# EAGLE design AIRDC (EAGLE 9.1.3)
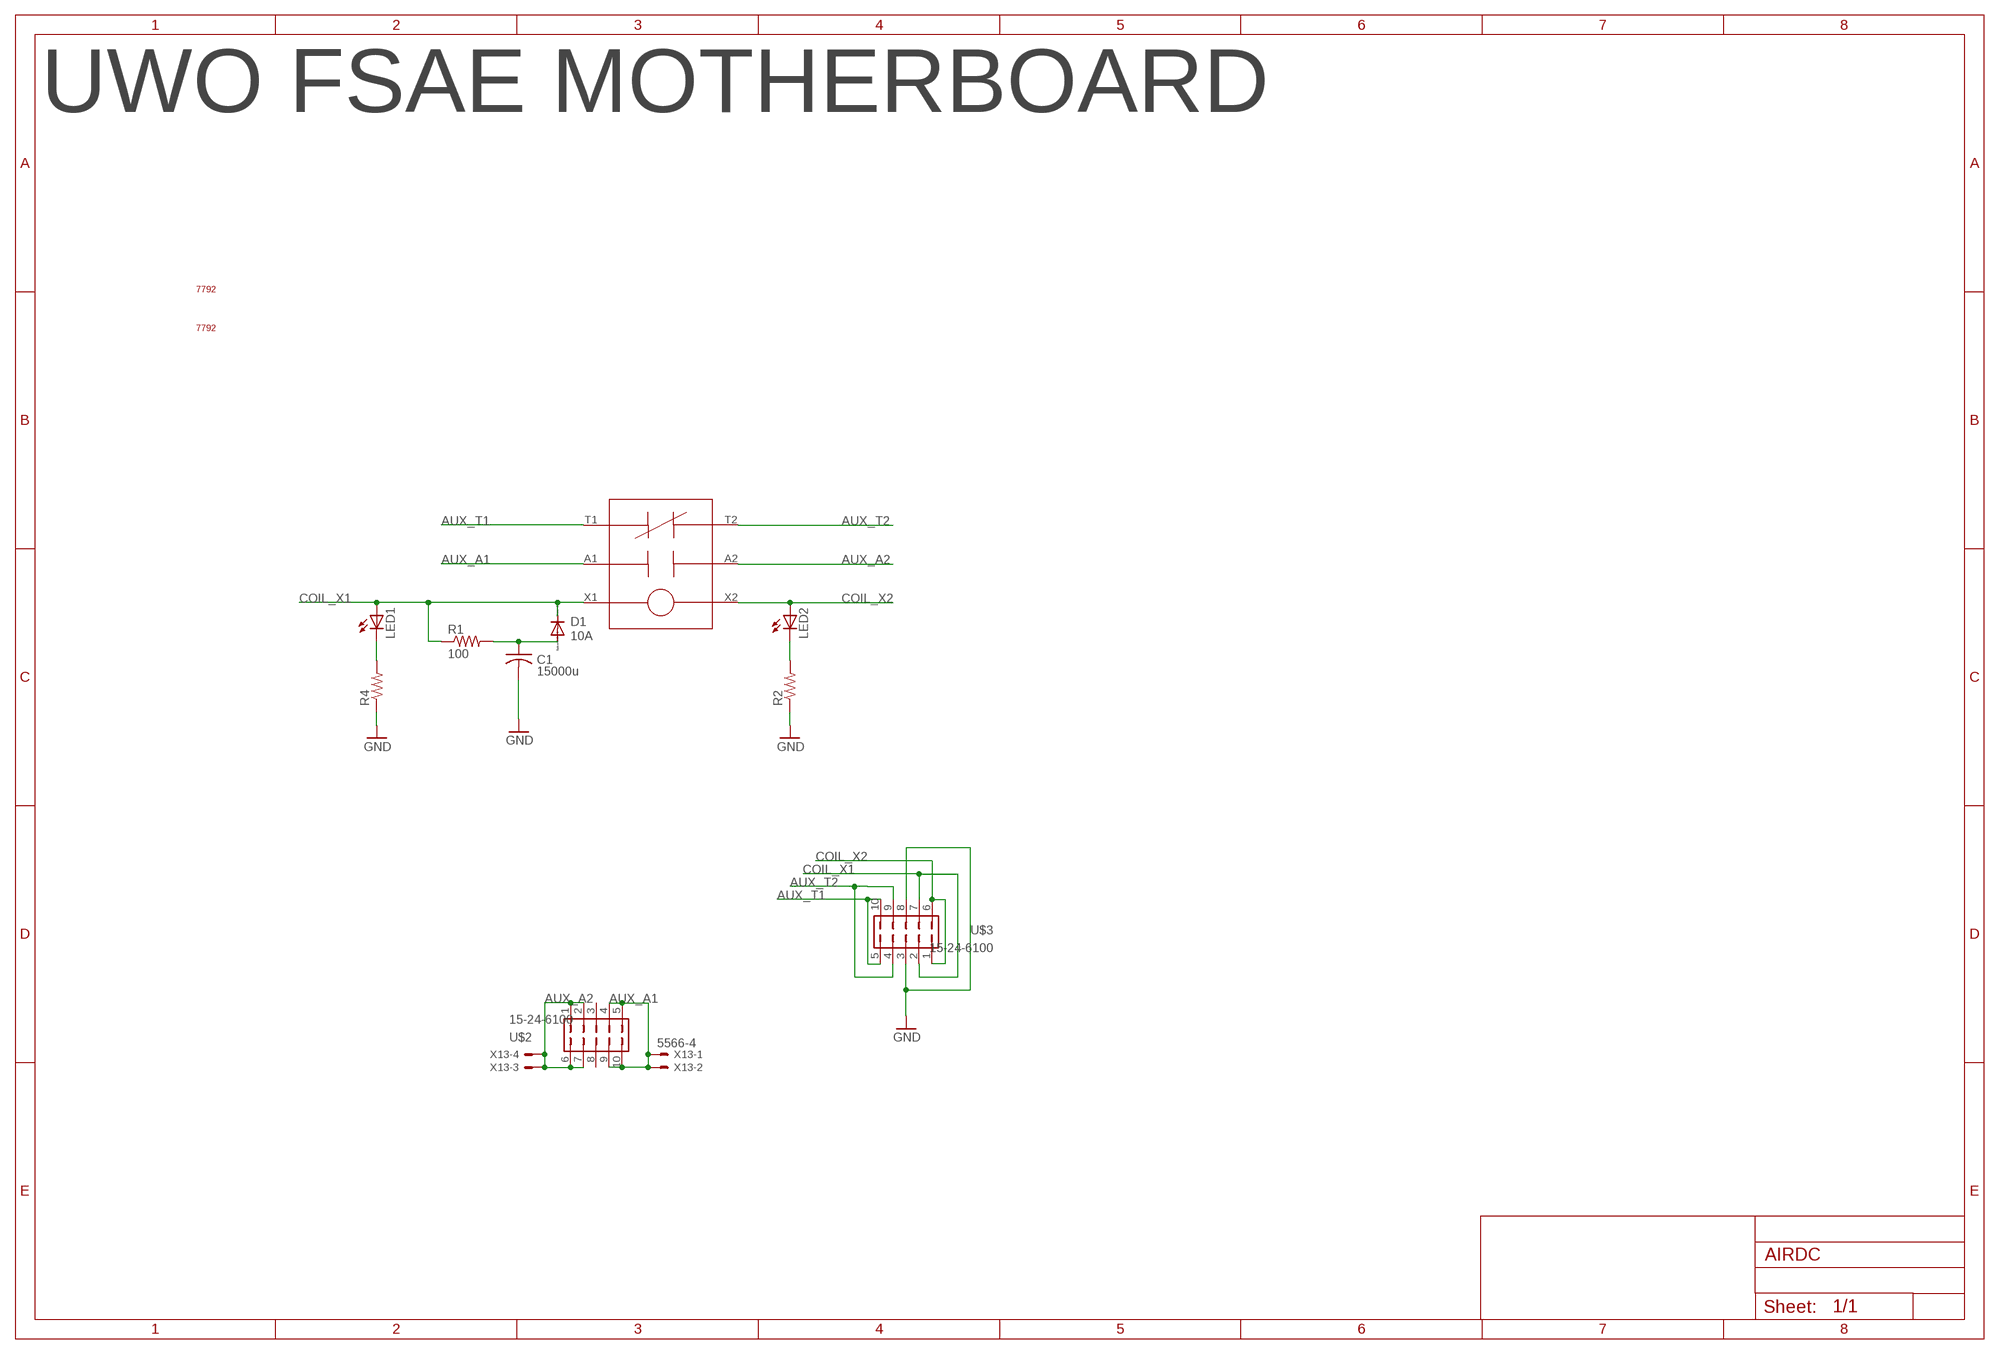
[diagram p0: schematic, sheet 1]

## Parts
C1  15000u  AIR_HOLDUP_CAP  [CAPPRD750W65D1800H3700B]
D1  10A  AIR_HOLDUP_DIODE  [DIOAD1570W120L850D500B]
LED1  LED3MM  [LED3MM]
LED2  LED3MM  [LED3MM]
R1  100  AIR_HOLDUP_RESISTOR  [RESAD976W63L650D250B]
R2  R-US_R0805  [R0805]
R4  R-US_R0805  [R0805]
U$1  GV224  [GV224]
U$2  15-24-6100  [15-24-6100]
U$3  15-24-6100  [15-24-6100]
U$4  7792  [7792]
U$5  7792  [7792]
X13  5566-4  [5566-4]

## Nets
AUX_A1 [HV]: U$1.A1 U$2.4 U$2.5 U$2.9 U$2.10 X13.1 X13.2
AUX_A2 [HV]: U$1.A2 U$2.1 U$2.2 U$2.6 U$2.7 X13.3 X13.4
AUX_T1: U$1.T1 U$3.5 U$3.10
AUX_T2: U$1.T2 U$3.4 U$3.9
COIL_X1: D1.1(C) LED1.A R1.1 U$1.X1 U$3.2 U$3.7
COIL_X2: LED2.A U$1.X2 U$3.1 U$3.6
GND: C1.2 R2.1 R4.1 U$3.3 U$3.8
N$1: LED2.K(C) R2.2
N$3: C1.1 D1.2(A) R1.2
N$5: LED1.K(C) R4.2
Unconnected: U$2.3 U$2.8

## Notes on the sheet
- UWO FSAE MOTHERBOARD

## Library data of the parts
C1 = Main:AIR_HOLDUP_CAP
D1 = Main:AIR_HOLDUP_DIODE
LED1 LED2 = ACC-MB-R0:LED: LED OSRAM: - CHIPLED LG R971, LG N971, LY N971, LG Q971, LY Q971, LO R971, LY R971 LH N974, LH R974 LS Q976, LO Q976, LY Q976 LO Q996 - Hyper CHIPLED LW Q18S LB Q993, LB Q99A, LB R99A - SideLED LS A670, LO A670, LY A670, LG A670, LP A670 LB A673, LV A673, LT A673, LW A673 LH A674 LY A675 LS A676, LA A676, LO A676, LY A676, LW A676 LS A679, LY A679, LG A679 - Hyper Micro SIDELED® LS Y876, LA Y876, LO Y876, LY Y876 LT Y87S - SmartLED LW L88C, LW L88S LB L89C, LB L89S, LG L890 LS L89K, LO L89K, LY L89K LS L896, LA L896, LO L896, LY L896 - TOPLED LS T670, LO T670, LY T670, LG T670, LP T670 LSG T670, LSP T670, LSY T670, LOP T670, LYG T670 LG T671, LOG T671, LSG T671 LB T673, LV T673, LT T673, LW T673 LH T674 LS T676, LA T676, LO T676, LY T676, LB T676, LH T676, LSB T676, LW T676 LB T67C, LV T67C, LT T67C, LS T67K, LO T67K, LY T67K, LW E67C LS E67B, LA E67B, LO E67B, LY E67B, LB E67C, LV E67C, LT E67C LW T67C LS T679, LY T679, LG T679 LS T770, LO T770, LY T770, LG T770, LP T770 LB T773, LV T773, LT T773, LW T773 LH T774 LS E675, LA E675, LY E675, LS T675 LS T776, LA T776, LO T776, LY T776, LB T776 LHGB T686 LT T68C, LB T68C - Hyper Mini TOPLED® LB M676 - Mini TOPLED Santana® LG M470 LS M47K, LO M47K, LY M47K Source: http://www.osram.convergy.de LUXEON: - LUMILED® LXK2-PW12-R00, LXK2-PW12-S00, LXK2-PW14-U00, LXK2-PW14-V00 LXK2-PM12-R00, LXK2-PM12-S00, LXK2-PM14-U00 LXK2-PE12-Q00, LXK2-PE12-R00, LXK2-PE12-S00, LXK2-PE14-T00, LXK2-PE14-U00 LXK2-PB12-K00, LXK2-PB12-L00, LXK2-PB12-M00, LXK2-PB14-N00, LXK2-PB14-P00, LXK2-PB14-Q00 LXK2-PR12-L00, LXK2-PR12-M00, LXK2-PR14-Q00, LXK2-PR14-R00 LXK2-PD12-Q00, LXK2-PD12-R00, LXK2-PD12-S00 LXK2-PH12-R00, LXK2-PH12-S00 LXK2-PL12-P00, LXK2-PL12-Q00, LXK2-PL12-R00 Source: www.luxeon.com KINGBRIGHT: KA-3528ASYC Source: www.kingbright.com
R1 = Main:AIR_HOLDUP_RESISTOR
R2 R4 = ACC-MB-R0:R-US_: RESISTOR, American symbol; SPICEPREFIX: R
U$1 = ACC-MB-R0:GV224
U$2 U$3 = ACC-MB-R0:15-24-6100
U$4 U$5 = ACC-MB-R0:7792
X13 = ACC-MB-R0:5566-4: Mini FIT connector 4 pol Source: http://www.molex.com; MF: MOLEX; OC_FARNELL: unknown; OC_NEWARK: unknown

## Net classes
0 default: width 1 mm, clearance 0.152 mm
1 LV: clearance 0.001 mm
2 HV: clearance 2.5 mm

## Board
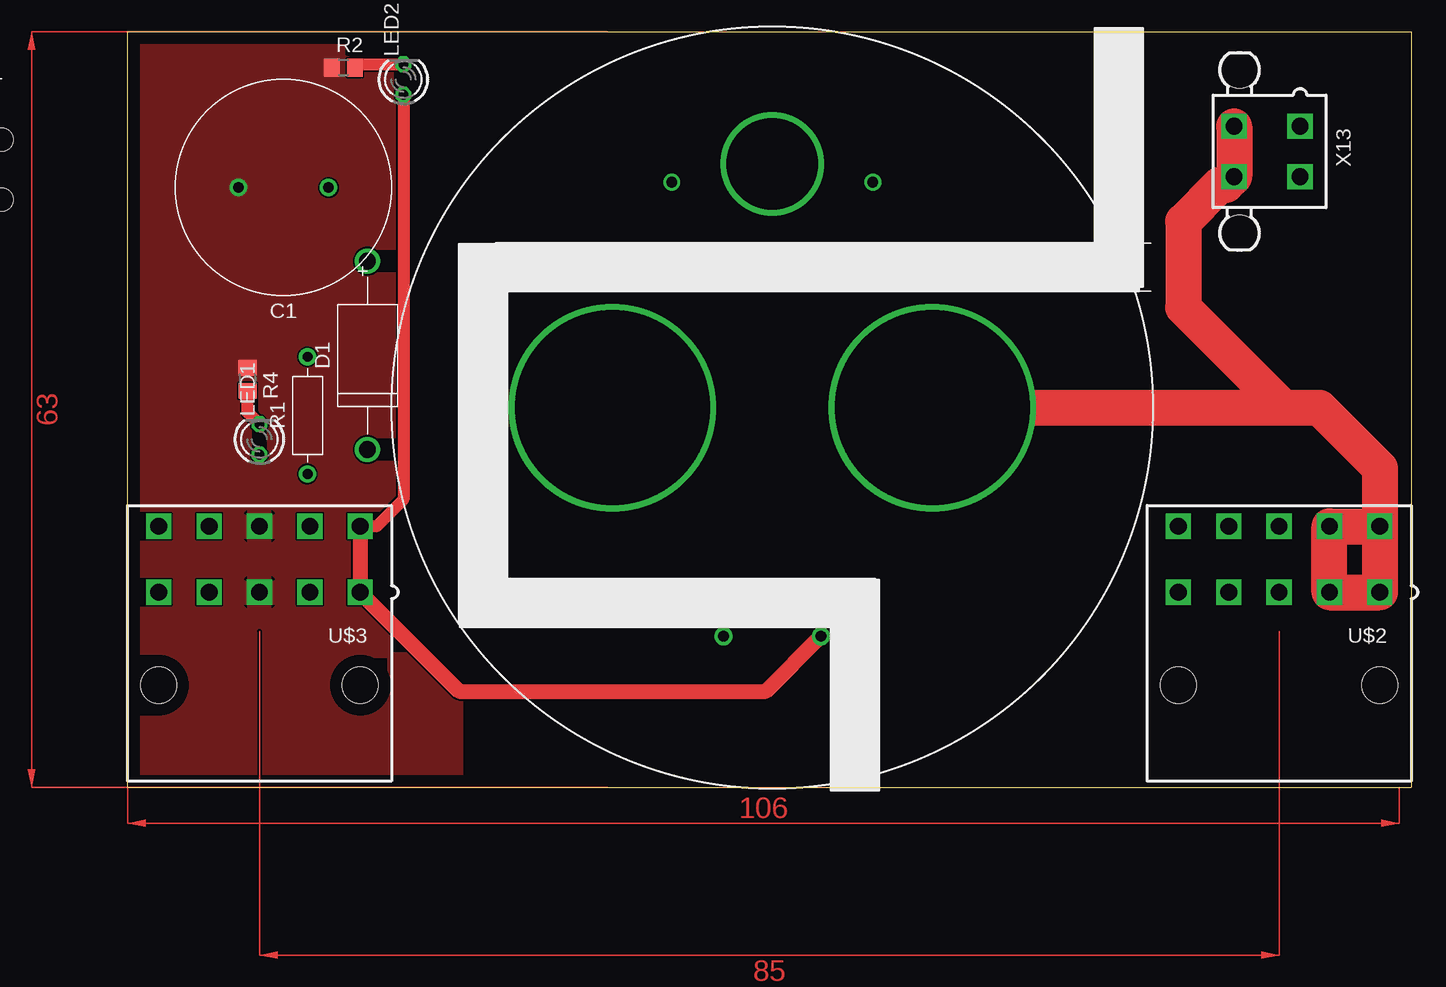
[diagram p1: board, top side]
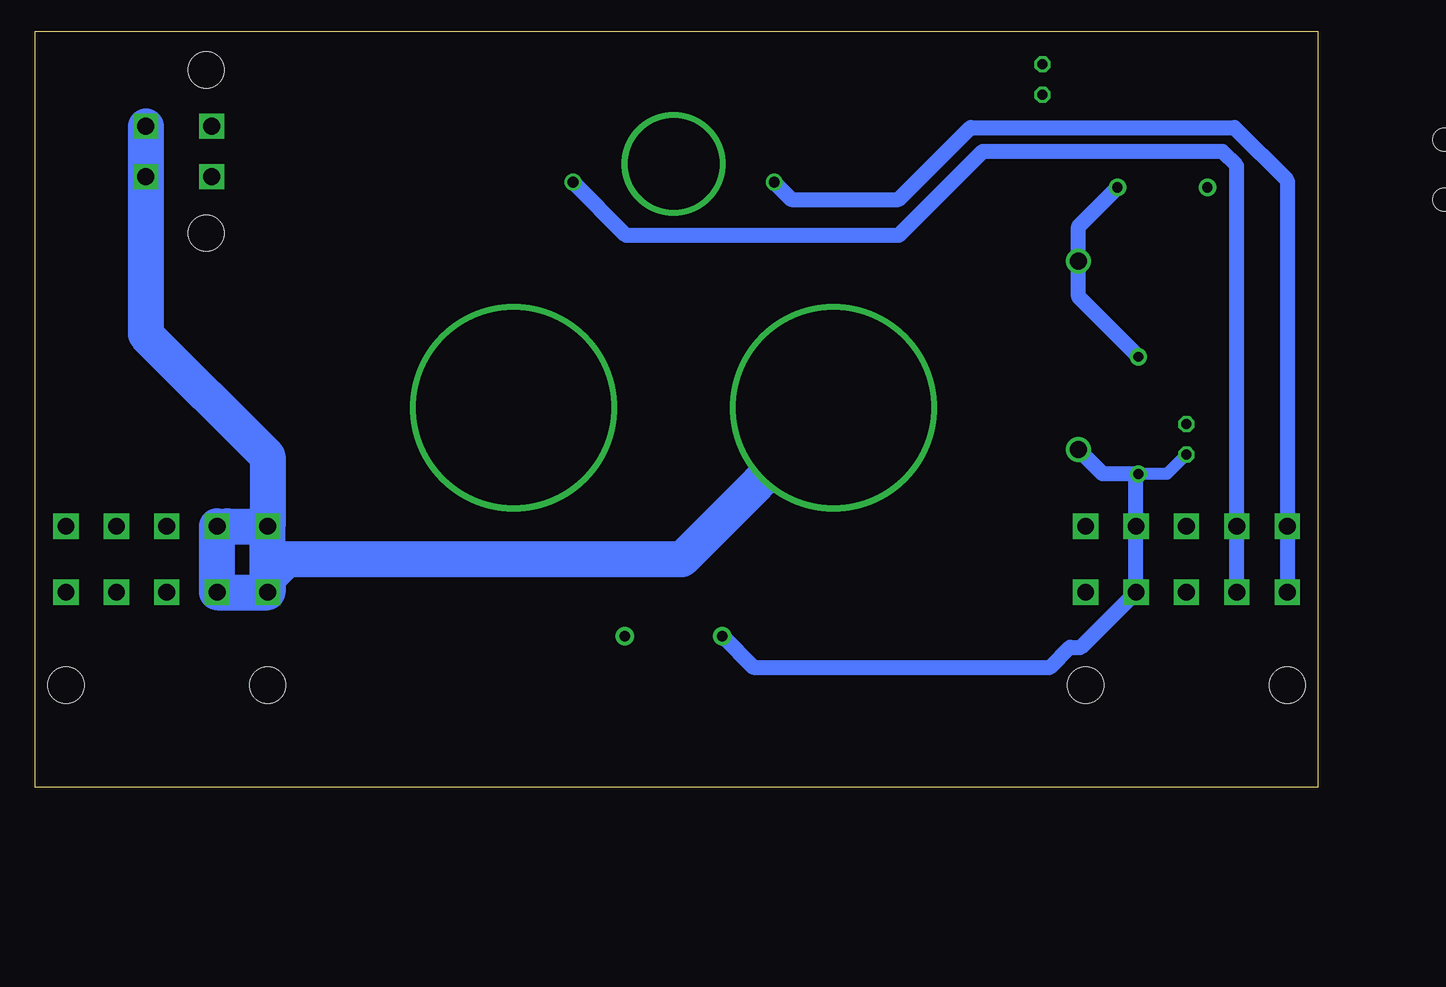
[diagram p2: board, bottom side, seen from below]

Size 107 x 63 mm. Coordinates in mm from the lower left corner, seen from the top.
Outline: 0,0 107,0 107,63 0,63 0,0
Copper layers (1*16): Top 0.035mm / dielectric 1.5mm / Bottom 0.035mm
Design rules "default": minimum track width 6mil, minimum drill 0.35mm, track to track 6mil, track to pad 6mil, pad to pad 6mil, via to via 6mil, smd to smd 6mil, copper to edge 40mil, drill to drill 6mil, minimum pad ring 10mil, minimum via ring 8mil, stop-mask expansion 4mil, vias tented up to drill 0mil, thermal gap 10mil

### Footprints (pad centres in the part's own frame; a part is rotated, then mirrored left to right if it is on the bottom)
CAPPRD750W65D1800H3700B = drill 0.85 pad 1.45: 1 -3.75,0; 2 3.75,0
DIOAD1570W120L850D500B = drill 1.4 pad 2.1: 1 -7.85,0; 2 7.85,0
LED3MM = drill 0.813 octagon: A -1.27,0; K 1.27,0
RESAD976W63L650D250B = drill 0.83 pad 1.43: 1 -4.88,0; 2 4.88,0
R0805 = smd 1.3 x 1.5: 1 -0.95,0; 2 0.95,0
GV224 = drill 16.256: A1 -13.335,19.05; A2 13.335,19.05 | drill 7.62: NC1 0,39.37 | drill 0.889: T1 -8.382,37.846; T2 8.382,37.846 | drill 0.889 pad 1.524: X1 -4.064,0; X2 4.064,0
15-24-6100 = drill 1.4 square: 1 8.4,-2.75; 2 4.2,-2.75; 3 0,-2.75; 4 -4.2,-2.75; 5 -8.4,-2.75; 6 8.4,2.75; 7 4.2,2.75; 8 0,2.75; 9 -4.2,2.75; 10 -8.4,2.75 | hole 3: 8.4,-10.5; -8.4,-10.5
7792 = hole 1.9: 0,5; 0,0; 7.5,0; 7.5,5
5566-4 = drill 1.4 square: 1 2.1,-2.75; 2 -2.1,-2.75; 3 2.1,2.75; 4 -2.1,2.75 | hole 3: 6.8,2.29; -6.8,2.29

### Placement (x,y rotation side)
C1  13,50 180 top
D1  20,36 90 top
LED1  11,29 90 top
LED2  23,59 90 top
R1  15,31 90 top
R2  18,60 0 top
R4  10,34 270 top
U$1  53.75,12.59 0 top
U$2  96,19 0 top
U$3  11,19 0 top
U$4  -18,49 0 top  (outside the outline)
U$5  113,51 0 top  (outside the outline)
X13  95,53 90 top

### Tracks (layer width: path | path; a pad name or v marks a point on that pad's centre or on a via)
AUX_A1
  Bottom 3: U$1.A1 53.05,19 86,19 87.6,17.4 U$2.5 | U$2.5 U$2.10 | 90.95,21.75 U$2.10 | U$2.10 U$2.9 U$2.4 U$2.5 | X13.1 X13.2 97.75,37.75 87.6,27.6 U$2.10
AUX_A2
  Top 3: U$1.A2 96,31.64 | 96,31.64 99.36,31.64 104.4,26.6 U$2.6 | U$2.6 U$2.1 U$2.2 U$2.7 U$2.6 | X13.3 X13.4 91.57,50.22 91.05,50.22 88,47.17 88,40 96,32 96,31.64
AUX_T1
  Bottom 1.27: U$1.T1 43.93,49 35,49 29,55 7,55 2.6,50.6 U$3.10 U$3.5
AUX_T2
  Bottom 1.27: U$3.4 U$3.9 6.8,51.8 8,53 28,53 35,46 57.7,46 U$1.T2
COIL_X1
  Bottom 1: LED1.A 12.61,26.12 R1.1
  Bottom 1.27: U$1.X1 47.1,10 22.36,10 20.7,11.65 19.8,11.65 U$3.2 U$3.7 15.2,25.92 R1.1 17.97,26.12 D1.1
COIL_X2
  Top 1: LED2.A 23,24 20.75,21.75 U$3.6
  Top 1.27: U$3.6 U$3.1 27.65,8 53.22,8 U$1.X2
GND
  pour Top: 0,63 0,0 27,0 27,63
N$1
  Top 1: R2.2 19.22,60.27 LED2.K
N$3
  Bottom 1.27: R1.2 20,40.88 D1.2 20,46.75 C1.1
N$5
  Top 1: LED1.K 10,31.27 R4.2
(copper drawn outside any net)
  shapes: Top area x3